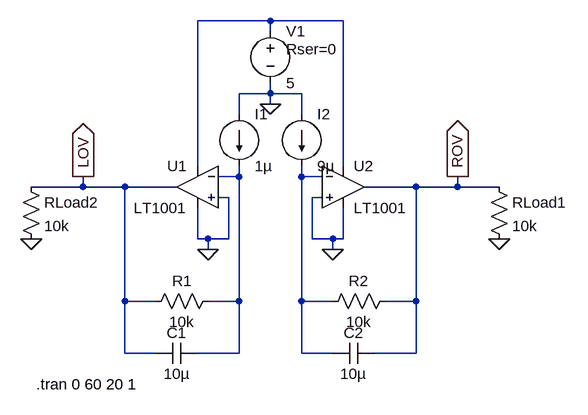
[diagram p0: schematic PSDOperating.asc]
PSDOperating.asc, the LTspice schematic file:
Version 4
SHEET 1 880 680
WIRE 256 -144 144 -144
WIRE 368 -144 256 -144
WIRE 256 -128 256 -144
WIRE 256 -32 256 -48
WIRE 256 -32 208 -32
WIRE 304 -32 256 -32
WIRE 256 -16 256 -32
WIRE 208 0 208 -32
WIRE 304 0 304 -32
WIRE 144 80 144 -144
WIRE 368 80 368 -144
WIRE 208 96 208 80
WIRE 208 96 176 96
WIRE 304 96 304 80
WIRE 336 96 304 96
WIRE -32 112 -32 96
WIRE -32 112 -112 112
WIRE 32 112 -32 112
WIRE 112 112 32 112
WIRE 480 112 400 112
WIRE 544 112 544 96
WIRE 544 112 480 112
WIRE 608 112 544 112
WIRE 192 128 176 128
WIRE 336 128 320 128
WIRE 144 192 144 144
WIRE 160 192 144 192
WIRE 192 192 192 128
WIRE 192 192 160 192
WIRE 320 192 320 128
WIRE 352 192 320 192
WIRE 368 192 368 144
WIRE 368 192 352 192
WIRE 160 208 160 192
WIRE 352 208 352 192
WIRE 32 288 32 112
WIRE 80 288 32 288
WIRE 208 288 208 96
WIRE 208 288 160 288
WIRE 304 288 304 96
WIRE 352 288 304 288
WIRE 480 288 480 112
WIRE 480 288 432 288
WIRE 32 368 32 288
WIRE 80 368 32 368
WIRE 208 368 208 288
WIRE 208 368 144 368
WIRE 304 368 304 288
WIRE 352 368 304 368
WIRE 480 368 480 288
WIRE 480 368 416 368
FLAG 160 208 0
FLAG 352 208 0
FLAG -32 96 LOV
IOPIN -32 96 Out
FLAG 544 96 ROV
IOPIN 544 96 Out
FLAG 256 -16 0
FLAG -112 192 0
FLAG 608 192 0
SYMBOL Opamps\\LT1001 144 48 M0
SYMATTR InstName U1
SYMBOL Opamps\\LT1001 368 48 R0
SYMATTR InstName U2
SYMBOL current 208 0 R0
WINDOW 123 0 0 Left 2
WINDOW 39 0 0 Left 2
SYMATTR InstName I1
SYMATTR Value 1µ
SYMBOL current 304 0 R0
WINDOW 123 0 0 Left 2
WINDOW 39 0 0 Left 2
SYMATTR InstName I2
SYMATTR Value 9µ
SYMBOL res 176 272 R90
WINDOW 0 0 56 VBottom 2
WINDOW 3 32 56 VTop 2
SYMATTR InstName R1
SYMATTR Value 10k
SYMBOL res 448 272 R90
WINDOW 0 0 56 VBottom 2
WINDOW 3 32 56 VTop 2
SYMATTR InstName R2
SYMATTR Value 10k
SYMBOL cap 144 352 R90
WINDOW 0 0 32 VBottom 2
WINDOW 3 32 32 VTop 2
SYMATTR InstName C1
SYMATTR Value 10µ
SYMBOL cap 416 352 R90
WINDOW 0 0 32 VBottom 2
WINDOW 3 32 32 VTop 2
SYMATTR InstName C2
SYMATTR Value 10µ
SYMBOL voltage 256 -144 R0
WINDOW 123 0 0 Left 2
WINDOW 39 24 44 Left 2
SYMATTR SpiceLine Rser=0
SYMATTR InstName V1
SYMATTR Value 5
SYMBOL res -128 96 R0
SYMATTR InstName RLoad2
SYMATTR Value 10k
SYMBOL res 592 96 R0
SYMATTR InstName RLoad1
SYMATTR Value 10k
TEXT -104 416 Left 2 !.tran 0 60 20 1

The netlist it stands for:
* PSDOperating.asc
XU1 0 N002 N001 0 LOV LT1001  ; pins In+ In- V+ V- OUT
XU2 0 N003 N001 0 ROV LT1001  ; pins In+ In- V+ V- OUT
I1 0 N002 1µ
I2 0 N003 9µ
R1 N002 LOV 10k
R2 ROV N003 10k
C1 N002 LOV 10µ
C2 ROV N003 10µ
V1 N001 0 5 Rser=0
RLoad2 LOV 0 10k
RLoad1 ROV 0 10k
.tran 0 60 20 1
.lib LTC.lib
.backanno
.end